# EAGLE design munia-ngc (EAGLE 8.2.2)

## Sheet 1 of 4: MCU
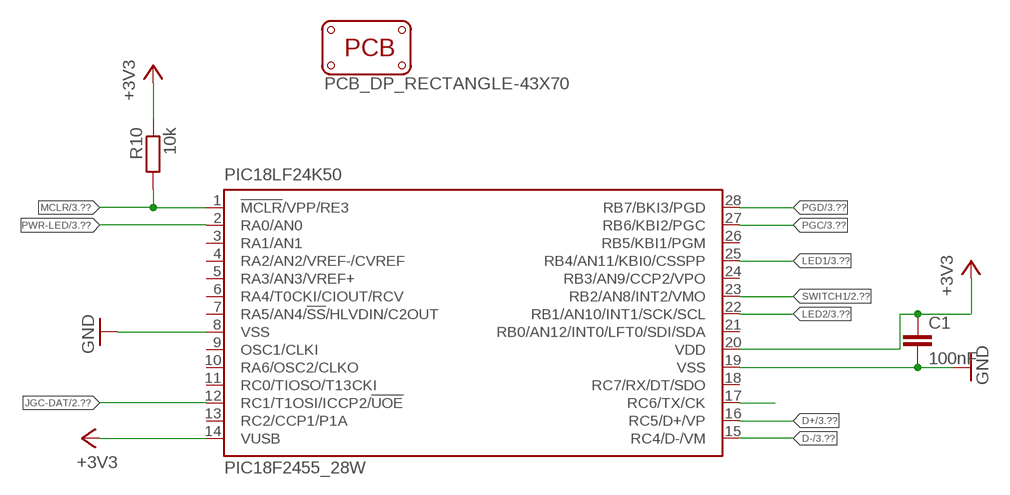
[diagram p0: schematic, sheet 1]

### Parts
C1  100nF  C-EUC0603  [C0603]
PCB1  PCB_DP_RECTANGLE-43X70  [DP7043_V1]
PIC18LF24K50  PIC18F2455_28W  [SO28W]
R10  10k  R-EU_R0603  [R0603]

### Nets
+3V3: C1.1 PIC18LF24K50.14(VUSB) PIC18LF24K50.20(VDD) R10.1 ; also sheet 2,3,4
D+: PIC18LF24K50.16(RC5/D+/VP) ; also sheet 3
D-: PIC18LF24K50.15(RC4/D-/VM) ; also sheet 3
GND: C1.2 PIC18LF24K50.8(VSS) PIC18LF24K50.19(VSS) ; also sheet 2,3,4
JGC-DAT: PIC18LF24K50.12(RC1/T1OSI/ICCP2/!UOE) ; also sheet 2,3
LED1: PIC18LF24K50.25(RB4/AN11/KBI0/CSSPP) ; also sheet 3
LED2: PIC18LF24K50.22(RB1/AN10/INT1/SCK/SCL) ; also sheet 3
MCLR: PIC18LF24K50.1(!MCLR!/VPP/RE3) R10.2 ; also sheet 3
N$2: PIC18LF24K50.17(RC6/TX/CK)
PGC: PIC18LF24K50.27(RB6/KBI2/PGC) ; also sheet 3
PGD: PIC18LF24K50.28(RB7/BKI3/PGD) ; also sheet 3
PWR-LED: PIC18LF24K50.2(RA0/AN0) ; also sheet 3
SWITCH1: PIC18LF24K50.23(RB2/AN8/INT2/VMO) ; also sheet 2
Unconnected: PIC18LF24K50.3(RA1/AN1) PIC18LF24K50.4(RA2/AN2/VREF-/CVREF) PIC18LF24K50.5(RA3/AN3/VREF+) PIC18LF24K50.6(RA4/T0CKI/CIOUT/RCV) PIC18LF24K50.7(RA5/AN4/!SS!/HLVDIN/C2OUT) PIC18LF24K50.9(OSC1/CLKI) PIC18LF24K50.10(RA6/OSC2/CLKO) PIC18LF24K50.11(RC0/TIOSO/T13CKI) PIC18LF24K50.13(RC2/CCP1/P1A) PIC18LF24K50.18(RC7/RX/DT/SDO) PIC18LF24K50.21(RB0/AN12/INT0/LFT0/SDI/SDA) PIC18LF24K50.24(RB3/AN9/CCP2/VPO) PIC18LF24K50.26(RB5/KBI1/PGM)

## Sheet 2 of 4: SIGNALS
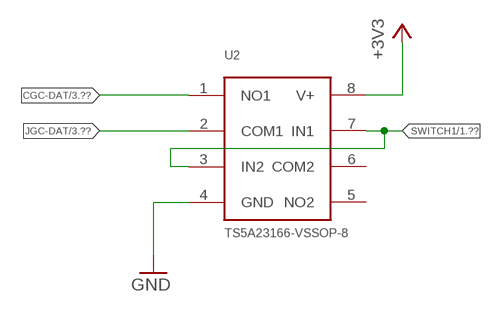
[diagram p1: schematic, sheet 2]

### Parts
U2  TS5A23166-VSSOP-8  [SOT765]

### Nets
+3V3: U2.8(V+) ; also sheet 1,3,4
CGC-DAT: U2.1(NO1) ; also sheet 3
GND: U2.4(GND) ; also sheet 1,3,4
JGC-DAT: U2.2(COM1) ; also sheet 1,3
SWITCH1: U2.3(IN2) U2.7(IN1) ; also sheet 1
Unconnected: U2.5(NO2) U2.6(COM2)

## Sheet 3 of 4: CONNECTORS
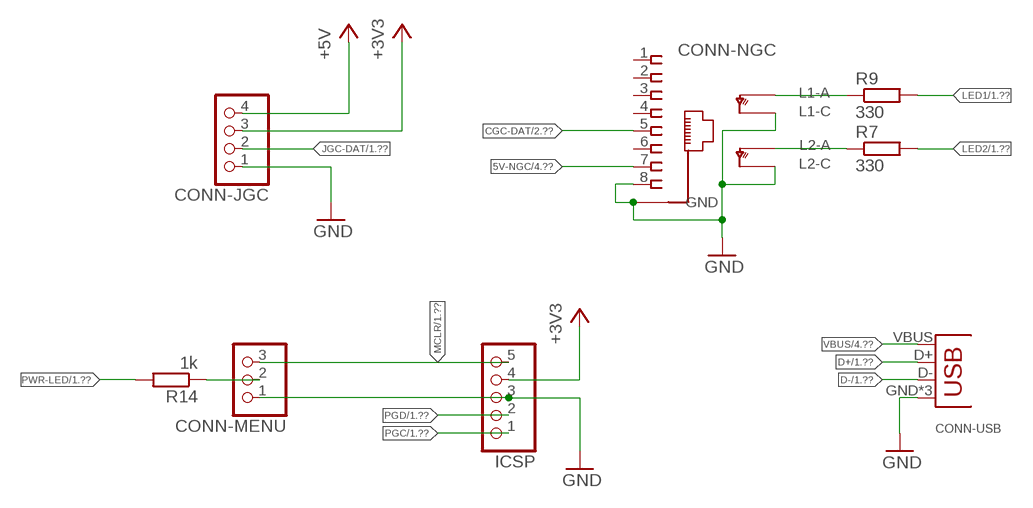
[diagram p2: schematic, sheet 3]

### Parts
CONN-JGC  PINHD-1X4  [1X04]
CONN-MENU  PINHD-1X3  [1X03]
CONN-NGC  RJ45-NIELS  [RJ45-NIELS]
CONN-USB  USB-B-NIELS  [USB-B-H]
ICSP  PINHD-1X5  [1X05]
R7  330  R-EU_R0603  [R0603]
R9  330  R-EU_R0603  [R0603]
R14  1k  R-EU_R0603  [R0603]

### Nets
5V-NGC: CONN-NGC.7 ; also sheet 4
+3V3: CONN-JGC.3 ICSP.4 ; also sheet 1,2,4
+5V: CONN-JGC.4 ; also sheet 4
CGC-DAT: CONN-NGC.5 ; also sheet 2
D+: CONN-USB.D+ ; also sheet 1
D-: CONN-USB.D- ; also sheet 1
GND: CONN-JGC.1 CONN-MENU.1 CONN-NGC.8 CONN-NGC.GND@5(GND) CONN-NGC.GND@6(GND) CONN-NGC.LED-GREEN-C(L2C) CONN-NGC.LED-ORANGE-C(L1C) CONN-USB.GND CONN-USB.GND@1(GND) CONN-USB.GND@2(GND) ICSP.3 ; also sheet 1,2,4
JGC-DAT: CONN-JGC.2 ; also sheet 1,2
LED1: R9.2 ; also sheet 1
LED2: R7.2 ; also sheet 1
MCLR: CONN-MENU.3 ICSP.5 ; also sheet 1
N$1: CONN-MENU.2 R14.1
N$8: CONN-NGC.LED-ORANGE-A(L1A) R9.1
N$23: CONN-NGC.LED-GREEN-A(L2A) R7.1
PGC: ICSP.1 ; also sheet 1
PGD: ICSP.2 ; also sheet 1
PWR-LED: R14.2 ; also sheet 1
VBUS: CONN-USB.VBUS ; also sheet 4
Unconnected: CONN-NGC.1 CONN-NGC.2 CONN-NGC.3 CONN-NGC.4 CONN-NGC.6

## Sheet 4 of 4: POWER
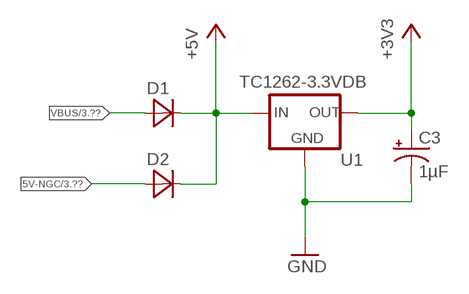
[diagram p3: schematic, sheet 4]

### Parts
C3  1µF  TANT-CAP1206  [EIA3216]
D1  MBR120VLSFT1G  [SOD123]
D2  MBR120VLSFT1G  [SOD123]
U1  TC1262-3.3VDB  [SOT230P700X180-4N]

### Nets
5V-NGC: D2.2(A) ; also sheet 3
+3V3: C3.A(+) U1.3(OUT) ; also sheet 1,2,3
+5V: D1.1(C) D2.1(C) U1.1(IN) ; also sheet 3
GND: C3.C(-) U1.2(GND) U1.4(GND) ; also sheet 1,2,3
VBUS: D1.2(A) ; also sheet 3

## Library data of the parts
C1 = resistor:C-EU: CAPACITOR, European symbol
C3 = Spark:TANT-CAP: Tantalum SMT
CONN-JGC = pinhead:PINHD-1X4: PIN HEADER
CONN-MENU = pinhead:PINHD-1X3: PIN HEADER
CONN-NGC = frank:RJ45-NIELS
CONN-USB = frank:USB: USB Connectors
D1 D2 = frank:MBR120VLSFT1G: DIODE, SCHOTTKY, 1A, 20V, SOD-123FL
ICSP = pinhead:PINHD-1X5: PIN HEADER
PCB1 = dp_pcb:PCB_DP_RECTANGLE: Dangerous Prototypes Standard Rectangular PCB sizes
PIC18LF24K50 = microchip:PIC18F2*_28: USB Microcontrollers with nanoWatt Technology High-Performance, Enhanced Flash, 28/40/44-Pin, Source: http://ww1.microchip.com/downloads/en/devicedoc/39632c.pdf; MF: MICROCHIP; MPN: PIC18F2455-I/SO; OC_FARNELL: 1579598; OC_NEWARK: 64J3768
R7 R9 R10 R14 = resistor:R-EU_: RESISTOR, European symbol
U1 = frank:TC1262-3.3VDB: IC, 500mA Fixed Output CMOS LDO,3.3V,SOT-223, 3-lead; MPN: TC1262-3.3VDB; OC_FARNELL: 1852183; OC_NEWARK: 53R0370; PACKAGE: SOT-223-3; SUPPLIER: Microchip
U2 = frank:TS5A23166

## Net classes
0 default: width 0.152 mm, drill 0.25 mm, clearance 0.152 mm

## Board
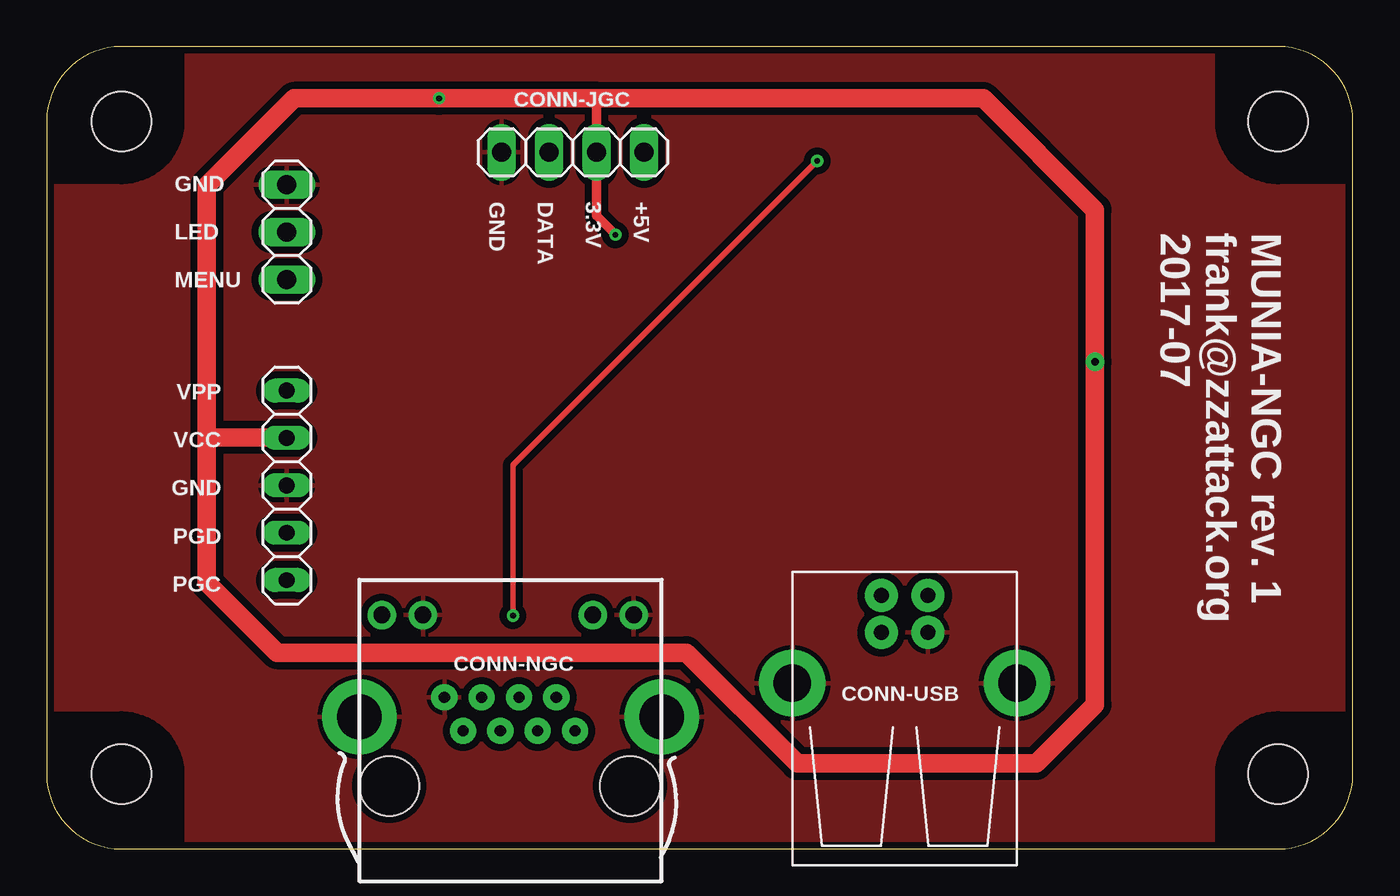
[diagram p4: board, top side]
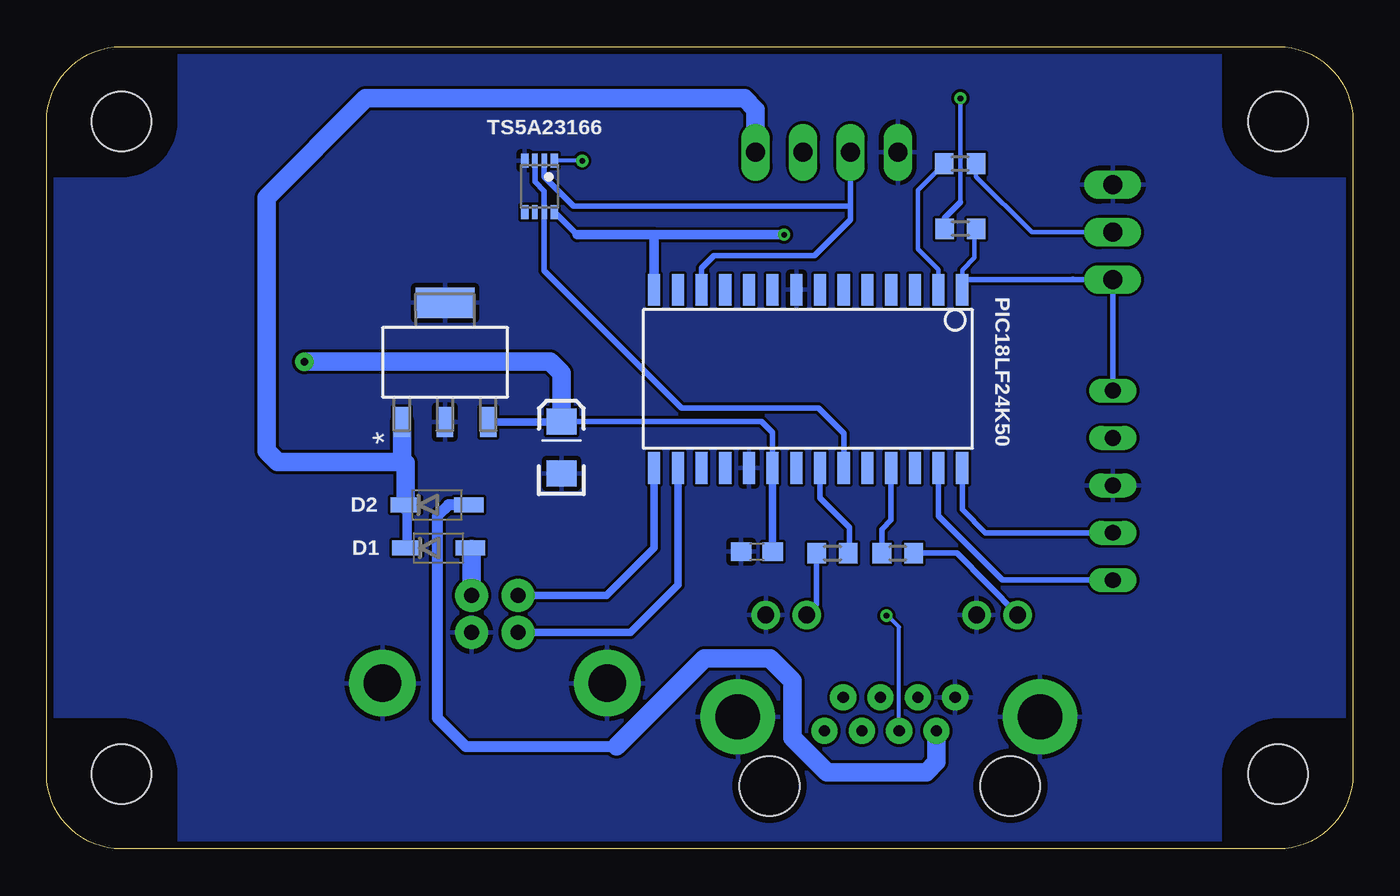
[diagram p5: board, bottom side, seen from below]

Size 70 x 43 mm. Coordinates in mm from the lower left corner, seen from the top.
Copper layers (1*16): Top 0.0356mm / dielectric 1.5011mm / Bottom 0.0356mm
Design rules "pcbway 6mil 0.3mm drills *": minimum track width 6mil, minimum drill 0.3mm, track to track 6mil, track to pad 6mil, pad to pad 6mil, via to via 6mil, smd to smd 6mil, copper to edge 15mil, drill to drill 6mil, minimum pad ring 7mil, minimum via ring 7mil, stop-mask expansion 4mil, vias tented up to drill 999mil, thermal gap 10mil

### Footprints (pad centres in the part's own frame; a part is rotated, then mirrored left to right if it is on the bottom)
C0603 = smd 1.1 x 1: 1 -0.85,0; 2 0.85,0
EIA3216 = smd 1.4 x 1.6: A 1.4,0; C -1.4,0
1X04 = drill 1.016 long: 1 -3.81,0; 2 -1.27,0; 3 1.27,0; 4 3.81,0
1X03 = drill 1.016 long: 1 -2.54,0; 2 0,0; 3 2.54,0
RJ45-NIELS = drill 0.6 pad 1.397: 1 3.93,-0.84; 2 2.93,0.96; 3 1.93,-0.84; 4 0.93,0.96; 5 -0.07,-0.84; 6 -1.07,0.96; 7 -2.07,-0.84; 8 -3.07,0.96 | drill 2.4 pad 4: GND@5 -7.62,-0.09; GND@6 8.58,-0.09 | drill 0.9 pad 1.524: LED-GREEN-A 4.88,5.37; LED-GREEN-C 7.08,5.37; LED-ORANGE-A -6.42,5.37; LED-ORANGE-C -4.22,5.37 | hole 3.2: -6.02,-3.79; 6.88,-3.79
USB-B-H = drill 0.8 pad 1.778: D+ 0,1.25; D- 1.981,1.25; GND 0,-1.25; VBUS 1.981,-1.25 | drill 2 pad 3.556: GND@1 -2.718,-6.02; GND@2 -2.718,6.02
SOD123 = smd 1.6 x 0.8: 1 -1.7,0; 2 1.7,0
1X05 = drill 0.85 long: 1 -5.08,0; 2 -2.54,0; 3 0,0; 4 2.54,0; 5 5.08,0
DP7043_V1 = hole 3.2: 4,4; 66,4; 66,39; 4,39
SO28W = smd 0.65 x 1.7: 1 -7.62,-4.78; 2 -6.35,-4.78; 3 -5.08,-4.78; 4 -3.81,-4.78; 5 -2.54,-4.78; 6 -1.27,-4.78; 7 0,-4.78; 8 1.27,-4.78; 9 2.54,-4.78; 10 3.81,-4.78; 11 5.08,-4.78; 12 6.35,-4.78; 13 7.62,-4.78; 14 8.89,-4.78; 15 8.89,4.78; 16 7.62,4.78; 17 6.35,4.78; 18 5.08,4.78; 19 3.81,4.78; 20 2.54,4.78; 21 1.27,4.78; 22 0,4.78; 23 -1.27,4.78; 24 -2.54,4.78; 25 -3.81,4.78; 26 -5.08,4.78; 27 -6.35,4.78; 28 -7.62,4.78
R0603 = smd 1 x 1.1: 1 -0.85,0; 2 0.85,0
SOT230P700X180-4N = smd 1.626 x 0.889: 1 -3.2,2.311; 2 -3.2,0; 3 -3.2,-2.311 | smd 1.626 x 3.175: 4 3.2,0
SOT765 = smd 0.4 x 0.75: 1 -0.8,-1.375; 4 0.8,-1.375; 5 0.8,1.375; 8 -0.8,1.375 | smd 0.3 x 0.75: 2 -0.25,-1.375; 3 0.25,-1.375; 6 0.25,1.375; 7 -0.25,1.375

### Placement (x,y rotation side)
C1  31.94,15.93 180 bottom
C3  42.42,21.51 90 bottom
CONN-JGC  28.19,37.34 0 top
CONN-MENU  12.87,33.06 270 top
CONN-NGC  24.38,7.16 0 top
CONN-USB  45.98,11.6 90 top
D1  48.99,16.13 0 bottom
D2  49.07,18.44 0 bottom
ICSP  12.87,19.49 90 top
PCB1  0,0 0 top
PIC18LF24K50  28.55,25.19 180 bottom
R7  27.89,15.85 0 bottom
R9  24.38,15.85 180 bottom
R10  21.03,33.24 0 bottom
R14  21.04,36.73 180 bottom
U1  48.65,26.08 90 bottom
U2  43.59,35.51 180 bottom

### Tracks (layer width: path | path; a pad name or v marks a point on that pad's centre or on a via)
5V-NGC
  Bottom 0.6: D2.2 48.46,18.44 49.07,17.83 49.07,7.01 47.55,5.49 39.47,5.49
  Bottom 1: 39.47,5.49 34.75,10.21 31.24,10.21 30.02,8.99 30.02,5.94 28.19,4.12 22.86,4.12 22.31,4.66 CONN-NGC.7
+3V3  (via drill 0.3, 0.4 pad 1)
  Top 0.305: 29.46,40.15 29.55,40.23
  Top 0.406: ICSP.4 13.53,22.06
  Top 0.508: 29.46,40.15 CONN-JGC.3 29.46,33.93 v30.48,32.92
  Top 1: 8.59,22.06 8.59,35.56 13.26,40.23 v21.03,40.23 29.55,40.23 50.19,40.23 56.19,34.24 v56.19,26.11 56.19,7.72 53.03,4.57 40.23,4.57 34.29,10.52 12.34,10.52 8.59,14.28 8.59,22.06 | 13.53,22.06 8.59,22.06
  Bottom 0.254: 21.03,34.67 v21.03,40.23
  Bottom 0.305: PIC18LF24K50.20 31.09,22.3 31.7,22.91 C3.A | R10.1 21.88,33.82 21.03,34.67 | 41.57,32.92 U2.8 | 37.44,32.85 37.38,32.92
  Bottom 0.406: C3.A 42.45,22.88 U1.3 | C1.1 31.09,16.7 PIC18LF24K50.20
  Bottom 0.508: v30.48,32.92 37.38,32.92 41.57,32.92 | PIC18LF24K50.14 37.44,32.85
  Bottom 1: C3.A 42.41,25.5 43.02,26.11 v56.19,26.11
+5V
  Bottom 0.508: 50.77,16.21 D1.1 50.69,18.36 D2.1 | 50.8,20.73 50.77,20.69
  Bottom 1: CONN-JGC.4 32,39.62 32.61,40.23 52.9,40.23 58.22,34.92 58.22,21.34 57.61,20.73 50.8,20.73 50.96,20.88 U1.1 | 50.77,20.69 D2.1
CGC-DAT  (via drill 0.3)
  Top 0.305: v24.99,12.5 24.99,20.57 v41.3,36.88
  Bottom 0.203: CONN-NGC.5 24.31,11.89 24.92,12.5 v24.99,12.5 | v41.3,36.88 U2.1
D+
  Bottom 0.406: PIC18LF24K50.16 36.17,14.14 38.71,11.6 CONN-USB.D+
D-
  Bottom 0.406: PIC18LF24K50.15 37.44,16.12 39.98,13.58 CONN-USB.D-
GND
  pour Top (isolate 0.381): 0,0 0,43 70,43 70,0
  pour Bottom: 0,0 70,0 70,43 0,43
JGC-DAT
  Bottom 0.305: PIC18LF24K50.12 34.9,31.14 34.24,31.8 28.85,31.8 26.92,33.73 26.92,34.45 | 26.92,34.45 26.92,35.67 | 26.92,35.67 CONN-JGC.2 | U2.2 43.34,36.02 42.98,35.66 41.77,34.45 26.92,34.45 | 26.93,35.66 26.92,35.67
LED1
  Bottom 0.305: 24.84,20.31 arc90 PIC18LF24K50.25 24.74,17.62 25.23,17.13 R9.2
LED2
  Bottom 0.305: R7.2 26.98,15.91 26.98,17.22 28.55,18.8 PIC18LF24K50.22
MCLR
  Bottom 0.254: 20.18,30.53 20.2,30.5 | PIC18LF24K50.1 20.93,31.03 20.27,31.7 20.27,33.16 R10.2
  Bottom 0.305: ICSP.5 CONN-MENU.3 | PIC18LF24K50.1 20.93,30.5 20.2,30.5 15.01,30.5 CONN-MENU.3 | CONN-MENU.3 15.02,30.53
N$1
  Bottom 0.254: CONN-MENU.2 17.21,33.06 20.19,36.04 R14.1
N$8
  Bottom 0.305: CONN-NGC.LED-ORANGE-A 21.23,15.85 R9.1
N$23
  Bottom 0.305: CONN-NGC.LED-GREEN-A 28.74,13.11 R7.1
PGC
  Bottom 0.305: PIC18LF24K50.27 22.2,17.84 18.77,14.4 ICSP.1
PGD
  Bottom 0.305: PIC18LF24K50.28 20.93,18.19 19.69,16.95 ICSP.2
PWR-LED
  Bottom 0.254: R14.2 23.32,35.3 23.32,32.16 22.2,31.04 PIC18LF24K50.2
SWITCH1
  Bottom 0.305: U2.3 43.84,35.76 43.34,35.26 U2.7 43.34,30.99 35.97,23.62 28.65,23.62 27.28,22.25 PIC18LF24K50.23
VBUS
  Bottom 0.508: 47.23,16.07 D1.2
  Bottom 1: CONN-USB.VBUS 47.23,16.07

### Text on the board
tNames: +5V / / 3.3V / / DATA / / GND | MUNIA-NGC rev. 1 / frank@zzattack.org / 2017-07 | GND / / LED / / MENU | VPP / / VCC / / GND / / PGD / / PGC
bNames: TS5A23166